# EAGLE design FIO-v18 (EAGLE 5.04)
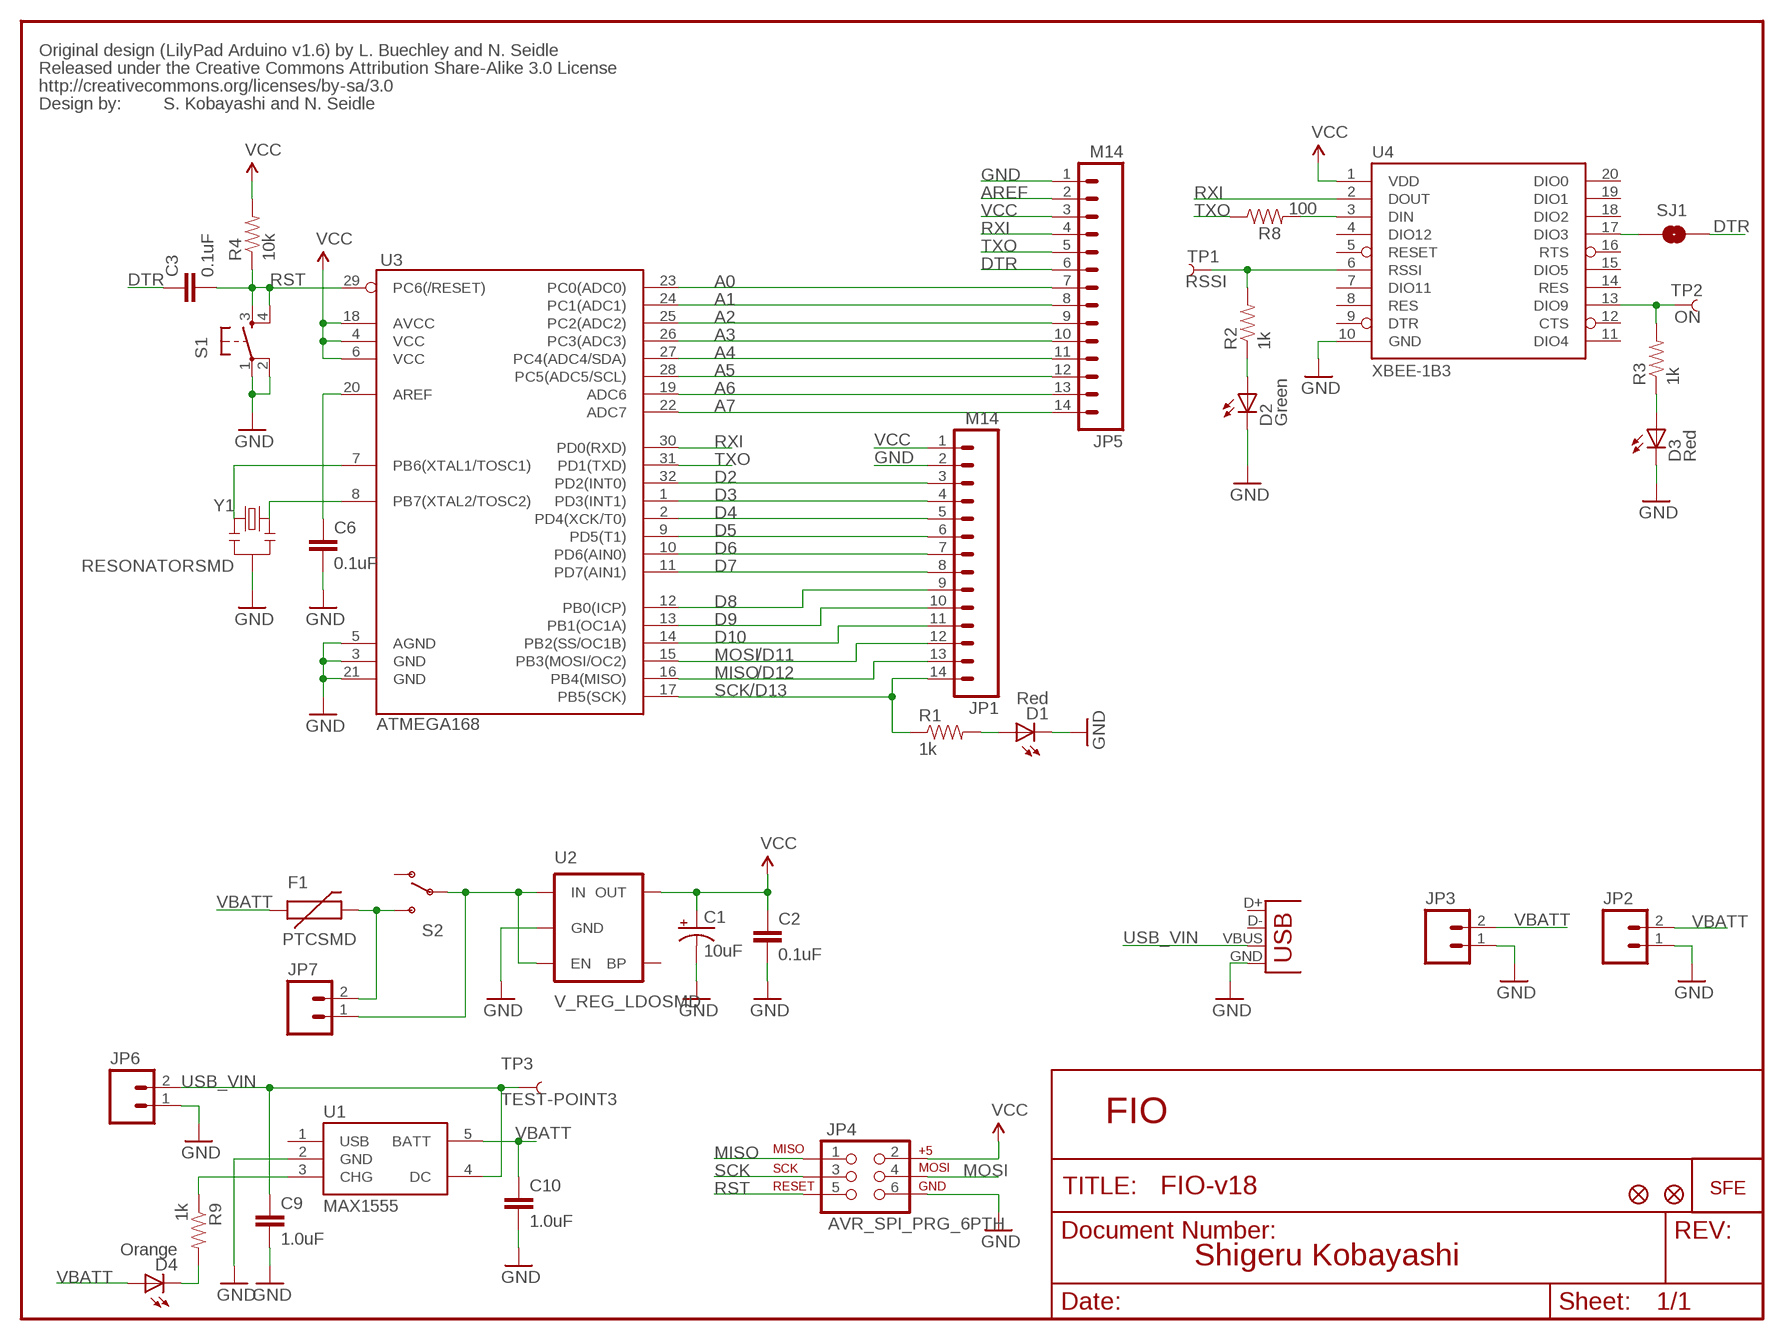
[diagram p0: schematic, sheet 1]

## Parts
C1  10uF  CAP_POL1206  [EIA3216]
C2  0.1uF  CAP0402-CAP  [0402-CAP]
C3  0.1uF  CAP0402-CAP  [0402-CAP]
C6  0.1uF  CAP0402-CAP  [0402-CAP]
C9  1.0uF  CAP0402-CAP  [0402-CAP]
C10  1.0uF  CAP0402-CAP  [0402-CAP]
D1  Red  LED0603  [LED-0603]
D2  Green  LED0603  [LED-0603]
D3  Red  LED0603  [LED-0603]
D4  Orange  LED0603  [LED-0603]
F1  PTCSMD  [PTC-1206]
JP1  M14  [1X14]
JP2  M02PTH  [1X02]
JP3  M02-JST-2MM-SMT  [S2B-PH]
JP4  AVR_SPI_PRG_6PTH  [2X3]
JP5  M14  [1X14]
JP6  M02PTH  [1X02]
JP7  M02PTH  [1X02]
R1  1k  RESISTOR0402-RES  [0402-RES]
R2  1k  RESISTOR0402-RES  [0402-RES]
R3  1k  RESISTOR0402-RES  [0402-RES]
R4  10k  RESISTOR0402-RES  [0402-RES]
R8  100  RESISTOR0402-RES  [0402-RES]
R9  1k  RESISTOR0402-RES  [0402-RES]
S1  TAC_SWITCHSMD  [TACTILE_SWITCH_SMD]
S2  SWITCH-SPSTSMD  [AYZ0202]
SJ1  SOLDERJUMPERNO  [SJ_2S-NO]
TP1  RSSI  TEST-POINT3X5  [PAD.03X.05]
TP2  ON  TEST-POINT3X5  [PAD.03X.05]
TP3  TEST-POINT3  [PAD.03X.03]
U1  MAX1555  [SOT23-5]
U2  V_REG_LDOSMD  [SOT23-5]
U3  ATMEGA168  [TQFP32-08]
U4  XBEE-1B3  [XBEE-SMD]
U$1  LOGO-SFENEW  [SFE-NEW-WEBLOGO]
U$3  CREATIVE_COMMONS  [CREATIVE_COMMONS]
U$4  FIDUCIAL1X2  [FIDUCIAL-1X2]
U$5  FIDUCIAL1X2  [FIDUCIAL-1X2]
X1  USBSMD  [USB-MINIB]
Y1  RESONATORSMD  [RESONATOR-SMD]

## Nets
A0: JP5.7 U3.23(PC0(ADC0))
A1: JP5.8 U3.24(PC1(ADC1))
A2: JP5.9 U3.25(PC2(ADC2))
A3: JP5.10 U3.26(PC3(ADC3))
A4: JP5.11 U3.27(PC4(ADC4/SDA))
A5: JP5.12 U3.28(PC5(ADC5/SCL))
A6: JP5.13 U3.19(ADC6)
A7: JP5.14 U3.22(ADC7)
AREF: C6.1 JP5.2 U3.20(AREF)
D2: JP1.3 U3.32(PD2(INT0))
D3: JP1.4 U3.1(PD3(INT1))
D4: JP1.5 U3.2(PD4(XCK/T0))
D5: JP1.6 U3.9(PD5(T1))
D6: JP1.7 U3.10(PD6(AIN0))
D7: JP1.8 U3.11(PD7(AIN1))
D8: JP1.9 U3.12(PB0(ICP))
D9: JP1.10 U3.13(PB1(OC1A))
D10: JP1.11 U3.14(PB2(SS/OC1B))
DTR: C3.1 JP5.6 SJ1.2
GND: C1.C(-) C2.2 C6.2 C9.2 C10.2 D1.C D2.C D3.C JP1.2 JP2.1 JP3.1 JP4.6 JP5.1 JP6.1 S1.1 S1.2 U1.2(GND) U2.2(GND) U3.3(GND) U3.5(AGND) U3.21(GND) U4.10(GND) X1.GND Y1.2
MISO: JP1.13 JP4.1 U3.16(PB4(MISO))
MOSI: JP1.12 JP4.4 U3.15(PB3(MOSI/OC2))
N$1: R3.2 TP2.P$1 U4.13(DIO9)
N$2: D1.A R1.2
N$3: D2.A R2.1
N$4: R2.2 TP1.P$1 U4.6(RSSI)
N$5: JP7.1 S2.2(P) U2.1(IN) U2.3(EN)
N$6: D3.A R3.1
N$7: R8.2 U4.3(DIN)
N$8: D4.C R9.2
N$9: F1.2 JP7.2 S2.3(S)
N$10: U3.7(PB6(XTAL1/TOSC1)) Y1.3
N$11: R9.1 U1.3(CHG)
N$12: U3.8(PB7(XTAL2/TOSC2)) Y1.1
N$13: SJ1.1 U4.17(DIO3)
RST: C3.2 JP4.5 R4.1 S1.3 S1.4 U3.29(PC6(/RESET))
RXI: JP5.4 U3.30(PD0(RXD)) U4.2(DOUT)
SCK: JP1.14 JP4.3 R1.1 U3.17(PB5(SCK))
TXO: JP5.5 R8.1 U3.31(PD1(TXD))
USB_VIN: C9.1 JP6.2 TP3.P$1 U1.4(DC) X1.VBUS
VBATT: C10.1 D4.A F1.1 JP2.2 JP3.2 U1.5(BATT)
VCC [VCC]: C1.A(+) C2.1 JP1.1 JP4.2 JP5.3 R4.2 U2.5(OUT) U3.4(VCC) U3.6(VCC) U3.18(AVCC) U4.1(VDD)
Unconnected: S2.1(O) U1.1(USB) U2.4(BP) U4.4(DIO12) U4.5(RESET) U4.7(DIO11) U4.8(RES) U4.9(DTR) U4.11(DIO4) U4.12(CTS) U4.14(RES) U4.15(DIO5) U4.16(RTS) U4.18(DIO2) U4.19(DIO1) U4.20(DIO0) X1.D+ X1.D-

## Notes on the sheet
- Original design (LilyPad Arduino v1.6) by L. Buechley and N. Seidle
- S. Kobayashi and N. Seidle
- /D11
- /D12
- /D13
- FIO
- Shigeru Kobayashi

## Library data of the parts
C1 = SparkFun:CAP_POL: Capacitor Polarized These are standard SMD and PTH capacitors. Normally 10uF, 47uF, and 100uF in electrolytic and tantalum varieties. Always verify the external diameter of the through hole cap, it varies with capacity, voltage, and manufacturer. The EIA devices should be standard.
C2 C3 C6 C9 C10 = SparkFun:CAP: Capacitor Standard 0603 ceramic capacitor, and 0.1" leaded capacitor.
D1-D4 = SparkFun:LED: LEDs Standard schematic elements and footprints for 5mm, 3mm, 1206, and 0603 sized LEDs. 5mm - Spark Fun Electronics SKU : COM-00529 (and others)
F1 = SparkFun:PTC: Resettable Fuse PTC Resettable Fuse. Spark Fun Electronics SKU : COM-08357
JP1 JP5 = SparkFun:M14: Header 14 Standard 14-pin 0.1" header. Use with straight break away headers (SKU : PRT-00116), right angle break away headers (PRT-00553), swiss pins (PRT-00743), machine pins (PRT-00117), and female headers (PRT-00115).
JP2 JP3 JP6 JP7 = SparkFun:M02: Header 2 Standard 2-pin 0.1" header. Use with straight break away headers (SKU : PRT-00116), right angle break away headers (PRT-00553), swiss pins (PRT-00743), machine pins (PRT-00117), and female headers (PRT-00115). Molex polarized connector foot print use with SKU : PRT-08233 with associated crimp pins and housings.
JP4 = SparkFun:AVR_SPI_PRG_6: AVR ISP 6 Pin This is the reduced ISP connector for AVR programming. Common on Arduino. This footprint will take up less PCB space and can be used with a 10-pin to 6-pin adapter such as SKU: BOB-08508
R1-R4 R8 R9 = SparkFun:RESISTOR: Resistor Basic schematic elements and footprints for 0603, 1206, and PTH 1/10th watt (small) resistors.
S1 = SparkFun:TAC_SWITCH: Momentary Switch Button commonly used for reset or general input. Spark Fun Electronics SKU : COM-00097
S2 = SparkFun:SWITCH-SPST: SPST Switch Simple slide switch. Spark Fun Electronics SKU : COM-00102
SJ1 = SparkFun:SOLDERJUMPER: Solder Jumper Standard SMD solder jumper. Used to automate production. Two varients : Normally Open and Normally Closed are the same, but have different paste layers. NC will have a large amount of paste and should jumper during reflow.
TP1-TP3 = SparkFun:TEST-POINT
U1 = SparkFun:MAX1555: MAX1555 Lithium Charger IC SOT-23 Lithium Polymer charging IC. Schematic element and footprint proven. Spark Fun Electronics SKU : COM-00674
U2 = SparkFun:V_REG_LDO: Voltage Regulator LDO Standard 150mA LDO voltage regulator in SOT-23 layout. Micrel part MIC5205. BP (by-pass) pin is used to lower output noise with 470pF cap.
U3 = SparkFun:ATMEGA168
U4 = SparkFun:XBEE-1
U$1 = SparkFun:LOGO-SFE: Spark Fun Electronics PCB Logo This is the standard Spark Fun Electronics PCB logo.
U$3 = SparkFun:CREATIVE_COMMONS
U$4 U$5 = SparkFun:FIDUCIAL: Fiducial Alignment Points Various fiducial points for machine vision alignment.
X1 = SparkFun:USB: USB Connectors USB-B-PTH is fully proven SKU : PRT-00139 USB-miniB is fully proven SKU : PRT-00587 USB-A-PCB is untested. USB-A-H is throughly reviewed, but untested. Spark Fun Electronics SKU : PRT-00437 USB-B-SMT is throughly reviewed, but untested. Needs silkscreen touching up. USB-A-S has not been used/tested USB-MB-H has not been used/tested
Y1 = SparkFun:RESONATOR: Resonator Small SMD resonator. This is the itty bitty 10/20MHz resonators with built in caps. CSTCE10M0G55 and CSTCE20M0V53. Footprint has been reviewed closely but hasn't been tested yet.

## Net classes
0 Default: width 0.203 mm
1 VCC: width 0.381 mm
2 LEDPower: width 0.203 mm
3 ButtonSignal: width 0.203 mm

## Board
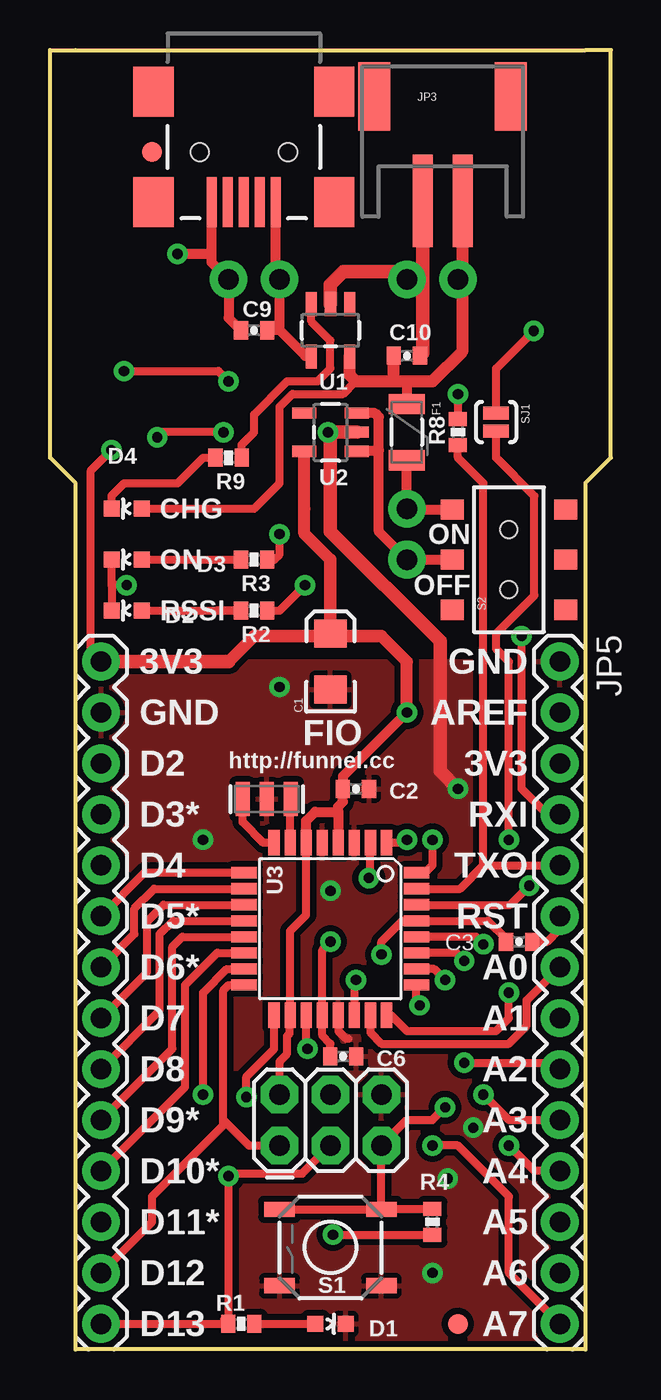
[diagram p1: board, top side]
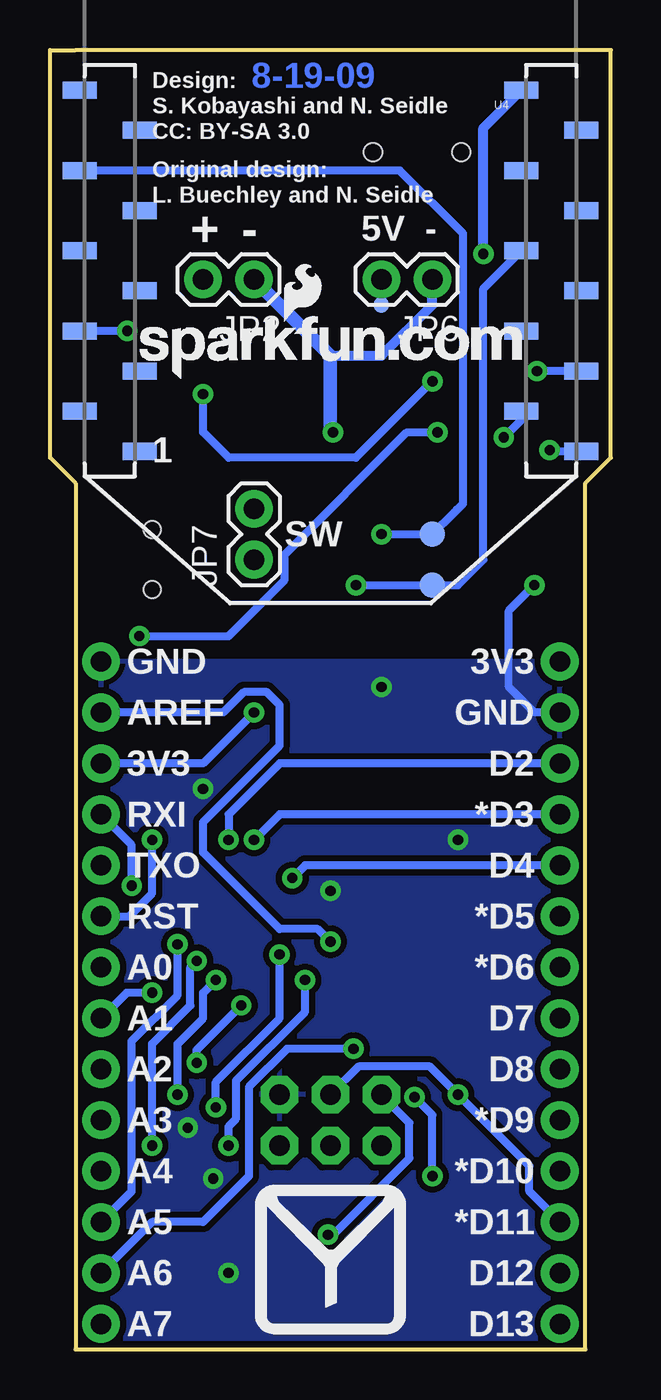
[diagram p2: board, bottom side, seen from below]

Size 27.94 x 64.77 mm. Coordinates in mm from the lower left corner, seen from the top.
Outline: 26.67,43.18 26.67,0 1.27,0 1.27,43.18 0,44.45 0,64.77 1.27,64.77 26.67,64.77 27.94,64.77 27.94,44.45 26.67,43.18
Copper layers (1*16): Top 0.035mm / dielectric 1.5mm / Bottom 0.035mm
Design rules "SparkFun *": minimum track width 8mil, minimum drill 20mil, track to track 8mil, track to pad 8mil, pad to pad 8mil, via to via 8mil, smd to smd 8mil, copper to edge 9mil, drill to drill 8mil, minimum pad ring 12mil, minimum via ring 10mil, stop-mask expansion 4mil, vias tented up to drill 20mil, thermal gap 10mil

### Footprints (pad centres in the part's own frame; a part is rotated, then mirrored left to right if it is on the bottom)
EIA3216 = smd 1.4 x 1.6: A 1.4,0; C -1.4,0
0402-CAP = smd 0.7 x 0.9: 1 -0.65,0; 2 0.65,0
LED-0603 = smd 0.8 x 0.8: A 0,-0.75; C 0,0.75
PTC-1206 = smd 1 x 1.8: 1 -1.4,0; 2 1.4,0
1X14 = drill 1.016 pad 1.88 round: 1 0,0; 2 2.54,0; 3 5.08,0; 4 7.62,0; 5 10.16,0; 6 12.7,0; 7 15.24,0; 8 17.78,0; 9 20.32,0; 10 22.86,0; 11 25.4,0; 12 27.94,0; 13 30.48,0; 14 33.02,0
1X02 = drill 1.016 pad 1.88 round: 1 0,0; 2 2.54,0
S2B-PH = smd 1 x 4.6: 1 -1,-3.7; 2 1,-3.7 | smd 1.6 x 3.4: NC1 -3.4,1.5; NC2 3.4,1.5
2X3 = drill 1.016 pad 1.88 octagon: 1 0,0; 2 0,2.54; 3 2.54,0; 4 2.54,2.54; 5 5.08,0; 6 5.08,2.54
0402-RES = smd 0.7 x 0.9: 1 -0.65,0; 2 0.65,0
TACTILE_SWITCH_SMD = smd 1.524 x 0.762: 1 -2.54,1.905; 2 2.54,1.905; 3 -2.54,-1.905; 4 2.54,-1.905
AYZ0202 = smd 1 x 1.15: 1 -2.5,2.825; 2 0,2.825; 3 2.5,2.825; 4 -2.5,-2.825; 5 0,-2.825; 6 2.5,-2.825 | hole 0.85: 1.5,0; -1.5,0
SJ_2S-NO = smd 0.635 x 1.27: 1 -0.45,0; 2 0.45,0
PAD.03X.05 = smd 1.27 x 1.27: P$1 0,0
PAD.03X.03 = smd 0.762 x 0.762: P$1 0,0
SOT23-5 = smd 0.55 x 1.2: 1 -0.95,-1.3; 2 0,-1.3; 3 0.95,-1.3; 4 0.95,1.3; 5 -0.95,1.3
TQFP32-08 = smd 1.27 x 0.559: 1 -4.293,2.8; 2 -4.293,2; 3 -4.293,1.2; 4 -4.293,0.4; 5 -4.293,-0.4; 6 -4.293,-1.2; 7 -4.293,-2; 8 -4.293,-2.8; 17 4.293,-2.8; 18 4.293,-2; 19 4.293,-1.2; 20 4.293,-0.4; 21 4.293,0.4; 22 4.293,1.2; 23 4.293,2; 24 4.293,2.8 | smd 0.559 x 1.27: 9 -2.8,-4.293; 10 -2,-4.293; 11 -1.2,-4.293; 12 -0.4,-4.293; 13 0.4,-4.293; 14 1.2,-4.293; 15 2,-4.293; 16 2.8,-4.293; 25 2.8,4.293; 26 2,4.293; 27 1.2,4.293; 28 0.4,4.293; 29 -0.4,4.293; 30 -1.2,4.293; 31 -2,4.293; 32 -2.8,4.293
XBEE-SMD = smd 1.7 x 0.85: 1 -12.5,20; 2 -9.5,18; 3 -12.5,16; 4 -9.5,14; 5 -12.5,12; 6 -9.5,10; 7 -12.5,8; 8 -9.5,6; 9 -12.5,4; 10 -9.5,2; 11 12.5,2; 12 9.5,4; 13 12.5,6; 14 9.5,8; 15 12.5,10; 16 9.5,12; 17 12.5,14; 18 9.5,16; 19 12.5,18; 20 9.5,20
FIDUCIAL-1X2 = smd 1 x 1: 1 0,0
USB-MINIB = smd 2.5 x 0.5: D+ 2.5,0; D- 2.5,0.8; GND 2.5,-1.6; ID 2.5,-0.8; VBUS 2.5,1.6 | smd 2.5 x 2: GND@1 -3,-4.5; GND@2 -3,4.5; GND@3 2.5,4.5; GND@4 2.5,-4.5 | hole 0.9: 0,2.2; 0,-2.2
RESONATOR-SMD = smd 0.7 x 1.7: 1 -1.2,0; 2 0,0; 3 1.2,0

### Placement (x,y rotation side)
C1  13.97,34.29 90 top
C2  15.24,27.94 0 top
C3  23.37,20.32 180 top
C6  14.61,14.61 0 top
C9  10.16,50.8 180 top
C10  17.78,49.53 0 top
D1  13.97,1.27 270 top
D2  3.81,36.83 90 top
D3  3.81,39.37 90 top
D4  3.81,41.91 90 top
F1  17.78,45.72 270 top
JP1  2.54,34.29 270 top
JP2  17.78,53.34 180 bottom
JP3  19.56,60.96 0 top
JP4  11.43,10.16 0 top
JP5  25.4,34.29 270 top
JP6  8.89,53.34 180 bottom
JP7  17.78,39.37 90 bottom
R1  9.53,1.27 0 top
R2  10.16,36.83 0 top
R3  10.16,39.37 0 top
R4  19.05,6.35 270 top
R8  20.32,45.72 90 top
R9  8.89,44.45 180 top
S1  13.97,5.08 180 top
S2  22.86,39.37 90 top
SJ1  22.22,46.23 270 top
TP1  8.89,38.1 0 bottom
TP2  8.89,40.64 0 bottom
TP3  11.43,52.07 0 bottom
U1  13.97,50.8 180 top
U2  13.97,45.72 90 top
U3  13.96,20.96 270 top
U4  13.97,64.77 180 bottom
U$1  23.5,48.39 0 bottom
U$2  [FUNNEL_LOGO_BOTTOM]  13.97,4.45 0 top
U$3  -11.43,-8.89 0 top  (outside the outline)
U$4  20.32,1.27 0 top
U$5  5.08,59.69 0 top
X1  9.65,59.69 270 top
Y1  10.79,27.43 0 top

### Tracks (layer width: path | path; a pad name or v marks a point on that pad's centre or on a via)
A0
  Top 0.406: U3.23 15.96,15.79 16.51,15.24 22.86,15.24 23.75,16.13 23.75,17.4 JP5.7
A1  (via drill 0.51)
  Top 0.406: U3.24 16.98,16.67 17.78,15.88 22.22,15.88 22.86,16.51 v22.86,17.78
  Bottom 0.406: v22.86,17.78 24.13,17.78 JP5.8
A2  (via drill 0.51)
  Top 0.406: U3.25 18.25,17.31 v18.41,17.14 | v20.64,14.29 25.08,14.29 JP5.9
  Bottom 0.406: v18.41,17.14 20.64,14.92 v20.64,14.29
A3  (via drill 0.51)
  Top 0.406: U3.26 19.13,18.96 v19.68,18.41 | v21.59,12.7 22.86,11.43 JP5.10
  Bottom 0.406: v19.68,18.41 20.32,17.78 20.32,16.51 21.59,15.24 v21.59,12.7
A4  (via drill 0.51)
  Top 0.406: U3.27 20.24,19.77 v20.64,19.37 | v22.86,10.16 24.13,8.89 JP5.11
  Bottom 0.406: v22.86,10.16 22.86,15.24 20.95,17.14 20.95,19.05 v20.64,19.37
A5  (via drill 0.51)
  Top 0.406: U3.28 21.22,20.57 v21.59,20.19
  Bottom 0.406: v21.59,20.19 21.59,17.65 23.88,15.37 23.88,7.87 JP5.12
A6  (via drill 0.51)
  Top 0.406: U3.19 12.76,14.99 v12.83,14.99
  Bottom 0.406: JP5.13 22.86,6.35 20.32,6.35 18.03,8.64 18.03,13.08 16.13,14.99 v12.83,14.99
A7  (via drill 0.51)
  Top 0.406: U3.22 15.16,18.34 v15.24,18.41 | v19.05,10.16 20.32,10.16 22.86,7.62 22.86,3.81 JP5.14
  Bottom 0.406: v15.24,18.41 15.24,16.83 18.67,13.4 18.67,11.49 19.05,11.11 v19.05,10.16
AREF  (via drill 0.51)
  Top 0.406: C6.1 13.97,15.24 13.56,15.65 U3.20 13.56,19.91 v13.97,20.32
  Bottom 0.406: v13.97,20.32 14.61,20.95 16.51,20.95 20.32,24.77 20.32,26.29 16.51,30.1 16.51,32.13 17.14,32.77 18.29,32.77 19.3,31.75 JP5.2
D2  (via drill 0.51)
  Top 0.406: U3.32 18.68,23.77 19.05,24.13 v19.05,25.4
  Bottom 0.406: JP1.3 13.97,29.21 | 13.97,29.21 14.61,29.21 | v19.05,25.4 19.05,26.67 16.51,29.21 13.97,29.21
D3  (via drill 0.51)
  Top 0.406: U3.1 17.64,25.26 v17.78,25.4
  Bottom 0.406: v17.78,25.4 16.51,26.67 JP1.4
D4  (via drill 0.51)
  Top 0.406: U3.2 15.96,23.58 v15.88,23.5
  Bottom 0.406: v15.88,23.5 15.24,24.13 JP1.5
D5
  Top 0.406: U3.9 4.71,23.77 JP1.6
D6
  Top 0.406: U3.10 5.19,22.96 4.19,21.97 4.19,20.7 JP1.7
D7
  Top 0.406: U3.11 5.65,22.16 4.83,21.34 4.83,18.8 JP1.8
D8
  Top 0.406: U3.12 6.12,21.36 5.46,20.7 5.46,16.89 JP1.9
D9
  Top 0.406: U3.13 6.6,20.57 6.1,20.07 6.1,14.99 JP1.10
D10
  Top 0.406: JP1.11 6.73,13.08 6.73,18.16 8.34,19.77 U3.14
DTR  (via drill 0.51)
  Top 0.406: C3.1 24.77,20.32 25.4,20.95 JP5.6 | v22.86,25.4 22.86,34.29 22.22,34.92 22.22,35.69 24.13,37.59 24.13,42.55 22.22,44.45 SJ1.2
  Bottom 0.406: JP5.6 24,21.59 22.86,22.73 v22.86,25.4
GND  (via drill 0.51)
  Top 0.254: JP2.1 18.56,53.34
  Top 0.406: D2.C 3.05,36.83 3.06,36.84 3.06,38.1 | 3.06,38.1 D3.C | 3.06,38.1 3.05,38.1 | v3.81,38.1 3.06,38.1 | U3.21 14.36,15.87 14.73,15.49 14.86,15.49
  Top 0.508: 8.05,54.61 8.05,54.18 JP6.1 8.89,51.42 C9.2 | 8.05,54.61 X1.GND | 8.05,54.61 v6.35,54.61
  Top 0.66: 18.56,53.72 JP3.1 | U1.2 13.97,53.09 14.61,53.72 18.56,53.72 | v20.32,27.94 19.43,28.83 19.43,35.31 13.97,40.77 13.97,45.72 v13.84,45.72 U2.2 | 18.56,53.72 18.56,53.34 18.56,49.67 18.41,49.53 C10.2
  Bottom 0.406: v3.81,38.1 5.08,36.83 5.08,33.02 3.81,31.75 JP1.2 | U4.10 4.54,62.77
  Bottom 0.508: 13.97,49.53 11.43,49.53 8.89,52.07 JP6.1 | v6.35,54.61 6.35,60.89 U4.10
  Bottom 0.66: v13.84,45.72 13.97,45.72 13.97,49.53 JP2.1
  other vias: 11.43,33.02 19.05,3.81 13.97,22.86 7.62,25.4 19.81,8.51 21.08,11.05
  pour Top (isolate 0.305): 1.27,34.29 26.67,34.29 26.67,0 1.27,0
  pour Bottom (isolate 0.305): 1.27,34.29 26.67,34.29 26.67,0 1.27,0
MISO
  Top 0.406: 10.79,10.16 JP4.1 9.91,10.16 8.64,11.43 | JP1.13 5.08,6.35 5.08,7.62 8.64,11.18 8.64,11.43 | U3.16 8.89,18.16 8.64,17.91 8.64,11.43
MOSI  (via drill 0.51)
  Top 0.406: U3.15 8.8,18.96 7.62,17.78 v7.62,12.7
  Bottom 0.406: JP1.12 4.06,7.87 4.06,9.14 v7.62,12.7 9.02,14.1 12.57,14.1 JP4.4
N$1  (via drill 0.51)
  Top 0.406: R3.2 11.18,39.37 11.43,39.62 v11.43,40.64
  Bottom 0.406: 7.81,41.72 TP2.P$1 v11.43,40.64 | 7.81,41.72 7.62,41.91 | U4.13 10.51,58.77 7.37,55.63 7.37,42.16 7.81,41.72
N$2
  Top 0.406: R1.2 D1.A
N$3
  Top 0.406: 8.26,36.83 R2.1 D2.A
N$4  (via drill 0.51)
  Top 0.406: v12.7,38.1 11.43,36.83 R2.2
  Bottom 0.254: v12.7,38.1 TP1.P$1
  Bottom 0.406: v12.7,38.1 TP1.P$1 7.62,38.1 6.35,39.37 6.35,52.89 U4.6
N$5
  Top 0.508: U2.3 16.2,46.67 16.38,46.48 16.38,44.83 | U2.1 16.32,44.77 16.38,44.83 | 16.38,44.83 16.38,40.77 JP7.1 S2.2
N$6
  Top 0.406: 9.53,39.37 R3.1 D3.A
N$7  (via drill 0.51)
  Top 0.406: v8.89,48.26 8.38,48.77 v3.68,48.77 | v20.32,47.62 R8.2
  Bottom 0.406: v8.89,48.26 12.7,44.45 19.05,44.45 20.32,45.72 v20.32,47.62 | U4.3 v3.68,48.77
N$8
  Top 0.406: R9.2 7.62,44.45 6.35,43.18 3.68,43.18 3.06,42.56 D4.C
N$9
  Top 0.508: S2.3 17.82,41.87 JP7.2 F1.2
  Top 0.635: F1.2
N$10
  Top 0.406: Y1.3 12.06,27.3 11.96,27.2 U3.7
N$11
  Top 0.406: U1.3 13.02,51.24 13.97,50.29 13.97,48.9 13.33,48.26 11.81,48.26 10.16,46.61 10.16,45.72 9.54,45.1 R9.1
N$12
  Top 0.406: Y1.1 9.59,26.28 10.62,25.26 U3.8
N$13  (via drill 0.51)
  Top 0.406: SJ1.1 22.22,48.9 23.75,50.42 v24.1,50.77
  Bottom 0.406: v24.1,50.77 U4.17
RST  (via drill 0.51)
  Top 0.406: v16.51,19.68 16.51,20.32 17.55,21.36 U3.29 21.82,21.36 22.72,20.46 C3.2 | S1.4 S1.3 | S1.3 JP4.5 17.78,11.43 19.05,11.43 v19.68,12.06 | S1.3 16.64,6.99 16.65,7 R4.1
  Bottom 0.406: v16.51,19.68 16.51,16.51 19.68,13.34 v19.68,12.06
RXI  (via drill 0.51)
  Top 0.406: v23.5,35.56 23.5,27.94 24.77,26.67 JP5.4 | U3.30 22.93,22.16 v23.88,23.11 | v8.64,45.72 5.59,45.72 v5.33,45.47
  Bottom 0.406: v23.5,35.56 19.05,35.56 16.26,38.35 16.26,39.62 10.16,45.72 v8.64,45.72 | U4.2 4.47,46.33 v5.33,45.47 | JP5.4 23.88,25.15 v23.88,23.11
SCK  (via drill 0.51)
  Top 0.406: U3.17 11.16,14.97 9.78,13.59 v9.78,12.57 | R1.1 8.68,1.49 | JP1.14 R1.1 | R1.1 v8.89,8.64 9.02,8.76 12.57,8.76 JP4.3 13.72,10.16
  Bottom 0.406: v9.78,12.57 8.89,11.68 v8.89,8.64
TXO
  Top 0.406: U3.31 20.43,22.96 21.59,24.13 | 21.59,24.13 JP5.5 | 21.59,24.13 21.59,43.18 20.32,44.45 R8.1
USB_VIN
  Top 0.508: X1.VBUS 11.25,53.52 JP6.2 11.43,50.8 | 11.43,50.8 12.7,49.53 12.99,49.53 U1.4 | 11.43,50.8 C9.1
  Bottom 0.508: JP6.2 TP3.P$1
VBATT
  Top 0.254: 20.57,53.34 20.56,53.34 JP2.2
  Top 0.406: D4.A 10.16,41.91 11.43,43.18 11.43,46.99 12.06,47.62 14.61,47.62 15.24,48.26
  Top 0.508: 17.78,48.26 F1.1
  Top 0.61: JP3.2 20.56,53.34 20.56,49.77 19.05,48.26 17.78,48.26 17.14,48.26 | 17.14,48.26 15.24,48.26 14.92,48.58 U1.5 | C10.1 17.13,48.27 17.14,48.26
VCC  (via drill 0.51)
  Top 0.406: U3.6 12.76,21.65 11.96,20.85 U3.18 11.94,16.65 11.94,15.75 11.81,15.62 11.81,14.73 11.43,14.35 JP4.2 | 12.67,41.91 12.7,41.91 | JP1.1 2.03,34.8 2.03,43.81 v3.05,44.83 | R4.2 14.11,5.7 v14.1,5.71
  Top 0.508: 14.36,26.8 14.36,27.06 | 14.36,26.8 U3.4 | U3.6 12.76,26.35 13.21,26.8 14.36,26.8 | v17.78,31.75 14.61,28.57 14.61,27.94 | 14.36,27.06 14.35,27.05 | C2.1 14.59,27.29 14.36,27.06
  Top 0.61: U2.5 12.67,41.91 12.67,40.67 13.97,39.37 | v17.78,31.75 17.78,34.29 16.51,35.56 | 10.16,35.56 8.89,34.29
  Top 0.635: C1.A 13.97,39.37 | C1.A 14.1,35.56 16.51,35.56 | C1.A 14.09,35.69 14.1,35.69 13.97,35.56 10.16,35.56 | C2.1 14.61,27.94
  Top 0.66: 8.89,34.29 JP1.1
  Bottom 0.406: JP5.3 20.32,29.21 v17.78,31.75 | U4.1 2.99,44.77 v3.05,44.83 | v14.1,5.71 13.84,5.71 10.03,9.53 10.03,11.3 JP4.2

### Text on the board
Bottom: 8-19-09
tPlace: CHG | ON | ON | OFF | RSSI | GND | 3V3 | AREF | GND | FIO | 3V3 | D2 | http://funnel.cc | RXI | D3* | TXO | D4 | RST | D5* | A0 | D6* | A1 | D7 | A2 | D8 | A3 | D9* | A4 | D10* | A5 | D11* | A6 | D12 | A7 | D13 | S. Kobayashi and N. Seidle
bPlace: Design: | S. Kobayashi and N. Seidle | CC: BY-SA 3.0 | Original design: | L. Buechley and N. Seidle | - | 5V | - | + | 1 | SW | 3V3 | GND | GND | AREF | D2 | 3V3 | *D3 | RXI | D4 | TXO | *D5 | RST | *D6 | A0 | D7 | A1 | D8 | A2 | *D9 | A3 | *D10 | A4 | *D11 | A5 | D12 | A6 | D13 | A7